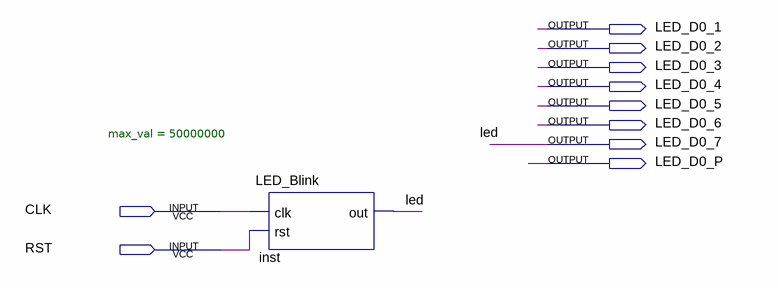
[diagram p0: schematic sheet]
// Quartus schematic Block1.bdf as structural Verilog: 1 symbols, 10 pins
module Block1 (
  input  CLK,
  input  RST,
  output LED_D0_1,
  output LED_D0_2,
  output LED_D0_3,
  output LED_D0_4,
  output LED_D0_5,
  output LED_D0_6,
  output LED_D0_7,
  output LED_D0_P
);

  LED_Blink #(.max_val(50000000)) inst (.clk(CLK), .rst(RST), .out(LED_D0_7));

  // Other names for the same wires on the sheet: led = LED_D0_7
endmodule
